# Altium schematic sheet Bi_Dir_Circuit.SchDoc
size A2; SheetNumber: 3; SheetTotal: 7
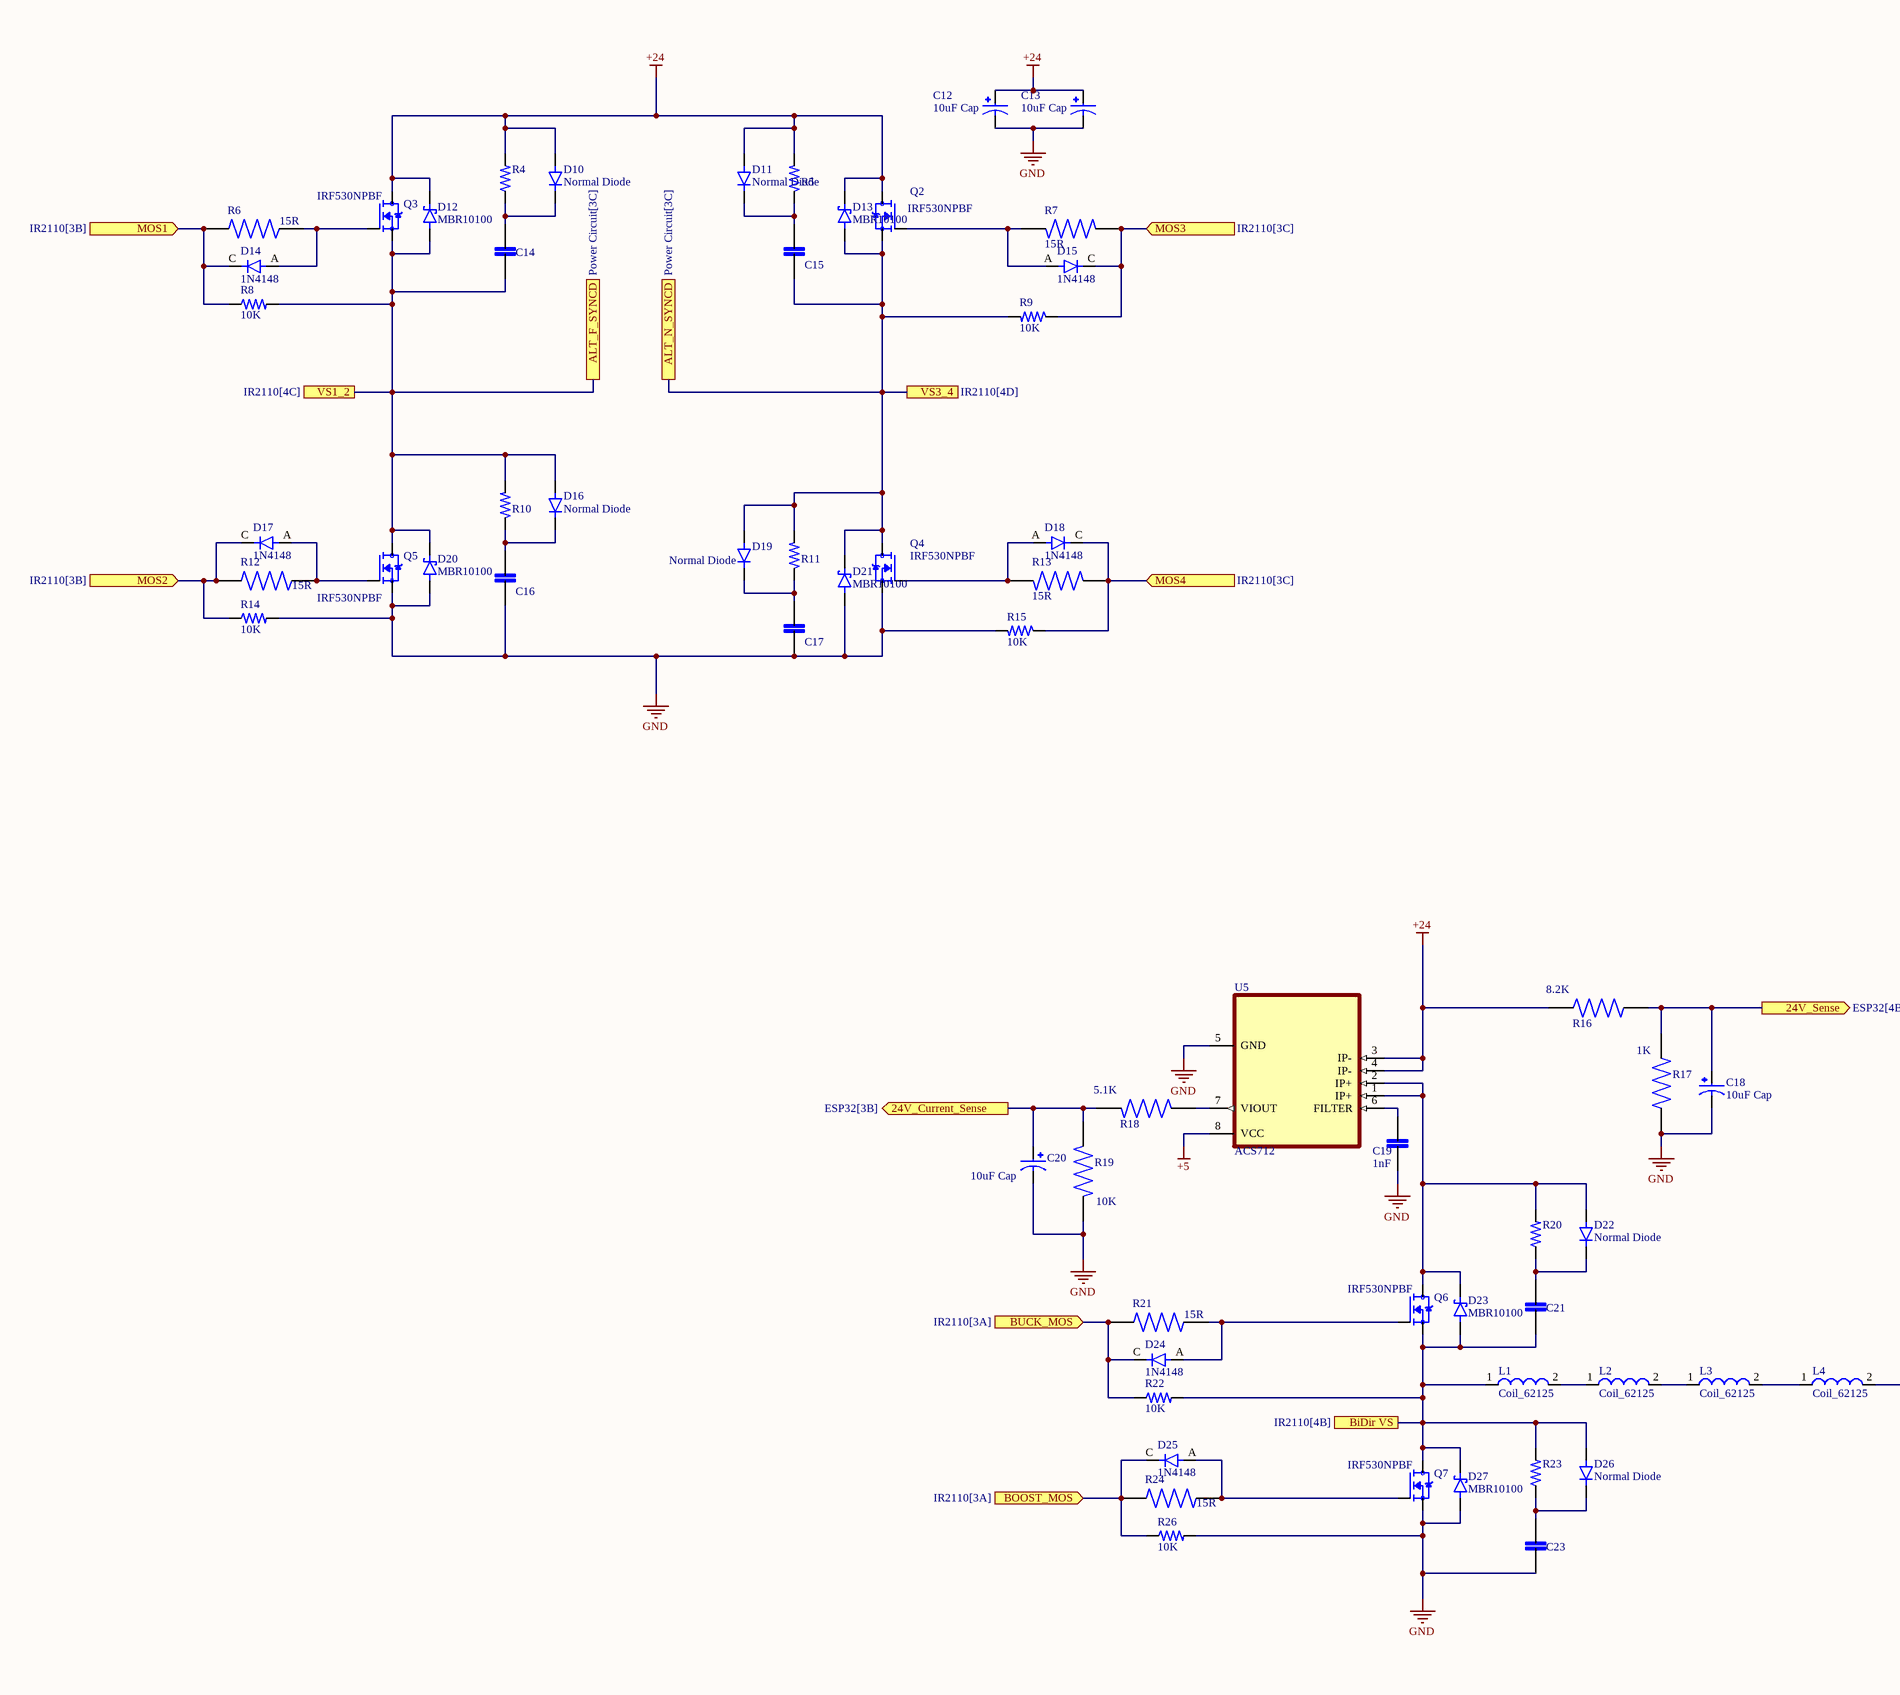
[diagram p0: Bi_Dir_Circuit.SchDoc, left]
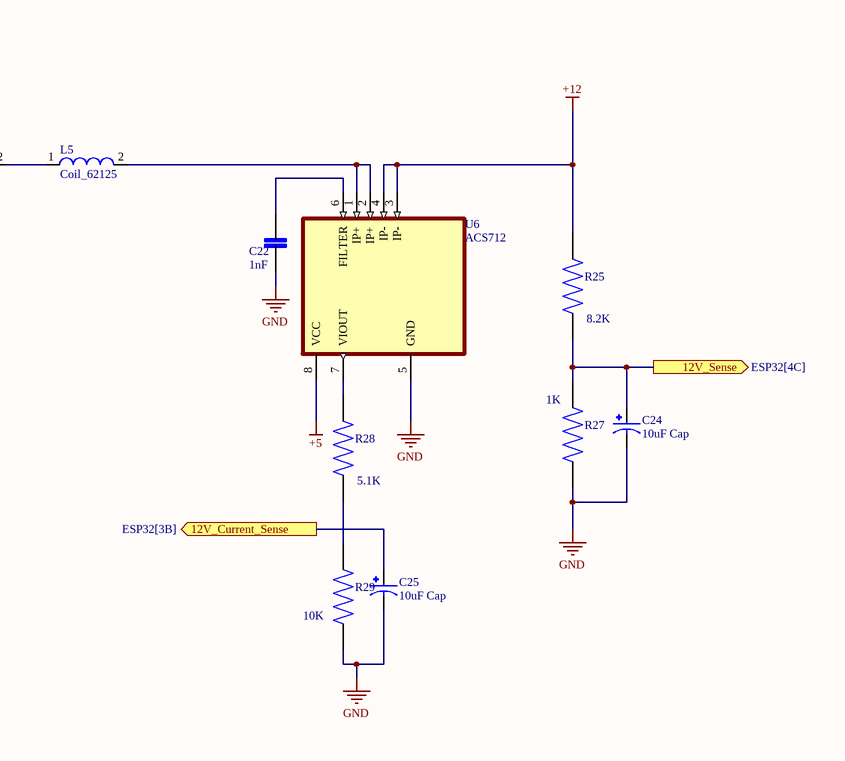
[diagram p1: Bi_Dir_Circuit.SchDoc, right]

## Parts
C12  10uF Cap  [2200uF_Cap]
C13  10uF Cap  [2200uF_Cap]
C14  Ceramic Capacitor  [Ceramic Capacitor]  (value not drawn)
C15  Ceramic Capacitor  [Ceramic Capacitor]  (value not drawn)
C16  Ceramic Capacitor  [Ceramic Capacitor]  (value not drawn)
C17  Ceramic Capacitor  [Ceramic Capacitor]  (value not drawn)
C18  10uF Cap  [CAP_10uF]
C19  1nF  [Ceramic Capacitor]
C20  10uF Cap  [CAP_10uF]
C21  Ceramic Capacitor  [Ceramic Capacitor]  (value not drawn)
C22  1nF  [Ceramic Capacitor]
C23  Ceramic Capacitor  [Ceramic Capacitor]  (value not drawn)
C24  10uF Cap  [CAP_10uF]
C25  10uF Cap  [CAP_10uF]
D10  Normal Diode  [Common Trhough Hole]
D11  Normal Diode  [Common Trhough Hole]
D12  MBR10100  [MBR10100]
D13  MBR10100  [MBR10100]
D14  1N4148  [1N4007 DIODE]
D15  1N4148  [1N4007 DIODE]
D16  Normal Diode  [Common Trhough Hole]
D17  1N4148  [1N4007 DIODE]
D18  1N4148  [1N4007 DIODE]
D19  Normal Diode  [Common Trhough Hole]
D20  MBR10100  [MBR10100]
D21  MBR10100  [MBR10100]
D22  Normal Diode  [Common Trhough Hole]
D23  MBR10100  [MBR10100]
D24  1N4148  [1N4007 DIODE]
D25  1N4148  [1N4007 DIODE]
D26  Normal Diode  [Common Trhough Hole]
D27  MBR10100  [MBR10100]
L1  Coil_62125  [Coil 65125]
L2  Coil_62125  [Coil 65125]
L3  Coil_62125  [Coil 65125]
L4  Coil_62125  [Coil 65125]
L5  Coil_62125  [Coil 65125]
Q2  IRF530NPBF  [IRF530N]
Q3  IRF530NPBF  [IRF530N]
Q4  IRF530NPBF  [IRF530N]
Q5  IRF530NPBF  [IRF530N]
Q6  IRF530NPBF  [IRF530N]
Q7  IRF530NPBF  [IRF530N]
R4  Resistor  [Resistor_Through Hole]  (value not drawn)
R5  Resistor  [Resistor_Through Hole]  (value not drawn)
R6  15R  [Resistor_Through Hole]
R7  15R  [Resistor_Through Hole]
R8  10K  [Resistor_Through Hole]
R9  10K  [Resistor_Through Hole]
R10  Resistor  [Resistor_Through Hole]  (value not drawn)
R11  Resistor  [Resistor_Through Hole]  (value not drawn)
R12  15R  [Resistor_Through Hole]
R13  15R  [Resistor_Through Hole]
R14  10K  [Resistor_Through Hole]
R15  10K  [Resistor_Through Hole]
R16  8.2K  [Resistor_Through Hole]
R17  1K  [Resistor_Through Hole]
R18  5.1K  [Resistor_Through Hole]
R19  10K  [Resistor_Through Hole]
R20  Resistor  [Resistor_Through Hole]  (value not drawn)
R21  15R  [Resistor_Through Hole]
R22  10K  [Resistor_Through Hole]
R23  Resistor  [Resistor_Through Hole]  (value not drawn)
R24  15R  [Resistor_Through Hole]
R25  8.2K  [Resistor_Through Hole]
R26  10K  [Resistor_Through Hole]
R27  1K  [Resistor_Through Hole]
R28  5.1K  [Resistor_Through Hole]
R29  10K  [Resistor_Through Hole]
U5  ACS712  [ACS712]
U6  ACS712  [ACS712]

## Ports
12V_Current_Sense (out, see ESP32[3B]), 12V_Sense (out, see ESP32[4C]), 24V_Current_Sense (out, see ESP32[3B]), 24V_Sense (out, see ESP32[4B]), ALT_F_SYNCD (see Power Circuit[3C]), ALT_N_SYNCD (see Power Circuit[3C]), BiDir VS (see IR2110[4B]), BOOST_MOS (in, see IR2110[3A]), BUCK_MOS (in, see IR2110[3A]), MOS1 (in, see IR2110[3B]), MOS2 (in, see IR2110[3B]), MOS3 (in, see IR2110[3C]), MOS4 (in, see IR2110[3C]), VS1_2 (see IR2110[4C]), VS3_4 (see IR2110[4D])

## Nets
+5: U5.8(VCC) U6.8(VCC)
+12: R25.2 U6.3(IP-) U6.4(IP-)
+24: C12.P C13.P D10.2(A) D11.2(A) D12.1(K) D13.1(K) Q2.2(D) Q3.2(D) R4.2 R5.2 R16.1 U5.3(IP-) U5.4(IP-)
GND: C12.N C13.N C16.1 C17.1 C18.N C19.1 C20.N C22.1 C23.1 C24.N C25.N D20.3(A) D21.3(A) D27.3(A) Q4.3(S) Q5.3(S) Q7.3(S) R14.2 R15.2 R17.1 R19.1 R26.2 R27.1 R29.1 U5.5(GND) U6.5(GND)
12V_Current_Sense: C25.P ; port 12V_Current_Sense
12V_Sense: C24.P R25.1 R27.2 ; port 12V_Sense
24V_Current_Sense: C20.P R18.1 R19.2 ; port 24V_Current_Sense
24V_Sense: C18.P R16.2 R17.2 ; port 24V_Sense
ALT_F_SYNCD: C14.1 D12.3(A) D16.2(A) D20.1(K) Q3.3(S) Q5.2(D) R8.2 R10.2 ; port VS1_2, port ALT_F_SYNCD
ALT_N_SYNCD: C15.1 D13.3(A) D19.2(A) D21.1(K) Q2.3(S) Q4.2(D) R9.2 R11.2 ; port VS3_4, port ALT_N_SYNCD
BiDir VS: C21.1 D23.3(A) D26.2(A) D27.1(K) L1.1 Q6.3(S) Q7.2(D) R22.2 R23.2 ; port BiDir VS
BOOST_MOS: D25.C R24.1 R26.1 ; port BOOST_MOS
BUCK_MOS: D24.C R21.1 R22.1 ; port BUCK_MOS
MOS1: D14.C R6.1 R8.1 ; port MOS1
MOS2: D17.C R12.1 R14.1 ; port MOS2
MOS3: D15.C R7.1 R9.1 ; port MOS3
MOS4: D18.C R13.1 R15.1 ; port MOS4
NetC14_2: C14.2 D10.1(K) R4.1
NetC15_2: C15.2 D11.1(K) R5.1
NetC16_2: C16.2 D16.1(K) R10.1
NetC17_2: C17.2 D19.1(K) R11.1
NetC19_2: C19.2 U5.6(FILTER)
NetC21_2: C21.2 D22.1(K) R20.1
NetC22_2: C22.2 U6.6(FILTER)
NetC23_2: C23.2 D26.1(K) R23.1
NetD14_A: D14.A Q3.1(G) R6.2
NetD15_A: D15.A Q2.1(G) R7.2
NetD17_A: D17.A Q5.1(G) R12.2
NetD18_A: D18.A Q4.1(G) R13.2
NetD22_2: D22.2(A) D23.1(K) Q6.2(D) R20.2 U5.1(IP+) U5.2(IP+)
NetD24_A: D24.A Q6.1(G) R21.2
NetD25_A: D25.A Q7.1(G) R24.2
NetL1_2: L1.2 L2.1
NetL2_2: L2.2 L3.1
NetL3_2: L3.2 L4.1
NetL4_2: L4.2 L5.1
NetL5_2: L5.2 U6.1(IP+) U6.2(IP+)
NetR18_2: R18.2 U5.7(VIOUT)
NetR28_1: R28.1 R29.2
NetR28_2: R28.2 U6.7(VIOUT)

## Library data of the parts
C12 C13 C18 C20 C24 C25 = 10uF Cap: CAP ALUM 10UF 20% 50V RADIAL; MP: ECE-A1HN100UI; MF: Panasonic; SnapEDA_Link: https://www.snapeda.com/parts/ECE-A1HN100UI/Panasonic/view-part/2321690/?ref=snap; Price: None; Check_prices: https://www.snapeda.com/parts/ECE-A1HN100UI/Panasonic/view-part/2321690/?ref=eda; Value: *; Availability: In Stock; Package: RADIAL-2 Panasonic
C14-C17 C19 C21-C23 = Ceramic Capacitor: MP: LD051A121KAB2A; MF: AVX; SnapEDA_Link: https://www.snapeda.com/parts/LD051A121KAB2A/AVX/view-part/?ref=snap; Package: 0805 AVX; Check_prices: https://www.snapeda.com/parts/LD051A121KAB2A/AVX/view-part/?ref=eda; Purchase-URL: https://pricing.snapeda.com/search/part/LD051A121KAB2A/?ref=eda; Price: None; Value: *; Availability: In Stock
D10 D11 D16 D19 D22 D26 = Normal Diode: MF: NTE Electronics, Inc.; MP: 1N4007; Package: DO-41 NTE Electronics; Check_prices: https://www.snapeda.com/parts/1N4007/NTE+Electronics/view-part/?ref=eda; Value: *; Purchase-URL: https://pricing.snapeda.com/search/part/1N4007/?ref=eda; Availability: In Stock; SnapEDA_Link: https://www.snapeda.com/parts/1N4007/NTE+Electronics/view-part/?ref=snap; Price: None
D12 D13 D20 D21 D23 D27 = MBR10100: MF: Diodes Inc.; MP: 1N5817-T; Package: DO-41 Diodes Inc.; Price: None; Check_prices: https://www.snapeda.com/parts/1N5817-T/Diodes+Inc./view-part/?ref=eda; Value: *; SnapEDA_Link: https://www.snapeda.com/parts/1N5817-T/Diodes+Inc./view-part/?ref=snap; Availability: In Stock; Purchase-URL: https://pricing.snapeda.com/search/part/1N5817-T/?ref=eda
D14 D15 D17 D18 D24 D25 = 1N4007: Diode Standard 1000 V 1A Through Hole DO-41; MF: NTE Electronics, Inc.; Package: DO-41 NTE Electronics; Check_prices: https://www.snapeda.com/parts/1N4007/NTE+Electronics/view-part/?ref=eda; Value: *; Purchase-URL: https://pricing.snapeda.com/search/part/1N4007/?ref=eda; Availability: In Stock; SnapEDA_Link: https://www.snapeda.com/parts/1N4007/NTE+Electronics/view-part/?ref=snap; MP: 1N4007; Price: None
L1-L5 = Coil_62125: Inductor Power Wirewound 470uH 10% 1KHz 25Q-Factor Ferrite 210mA 3.3Ohm DCR T/R; MF: Bourns; MP: SDR0604-471KL; Digi-Key_Part_Number: SDR0604-471KLCT-ND; Package: Nonstandard Bourns; Value: *; SnapEDA_Link: https://www.snapeda.com/parts/SDR0604-471KL/Bourns/view-part/567387/?ref=snap; Digi-Key_Purchase_URL: https://www.digikey.com/product-detail/en/bourns-inc/SDR0604-471KL/SDR0604-471KLCT-ND/2352941?utm_source=snapeda&utm_medium=aggregator&utm_campaign=symbol
Q2-Q7 = IRF530NPBF: RoHS Compliant | Low RDS(on) | Industry-leading quality | Dynamic dv/dt Rating | Fast Switching | Fully Avalanche Rated | 175C Operating Temperature; MF: Infineon Technologies; Purchase-URL: https://pricing.snapeda.com/search/part/IRF530NPBF/?ref=eda; Check_prices: https://www.snapeda.com/parts/IRF530NPBF/Infineon+Technologies/view-part/?ref=eda; SnapEDA_Link: https://www.snapeda.com/parts/IRF530NPBF/Infineon+Technologies/view-part/?ref=snap; Price: None; Availability: In Stock; Package: TO-220 Infineon; MP: IRF530NPBF; Value: *
R4 R5 R8-R11 R14 R15 R20 R22 R23 R26 = Resistor: Power_Rating: .25 W; MP: 2-2176053-0; Tolerance: 1%; Resistance: .33; MF: TE Connectivity; Price: None; Availability: In Stock; EU_RoHS_Compliance: Compliant with Exemptions; Package: 0805; Value: *; SnapEDA_Link: https://www.snapeda.com/parts/2-2176053-0/TE+Connectivity/view-part/?ref=snap; Check_prices: https://www.snapeda.com/parts/2-2176053-0/TE+Connectivity/view-part/?ref=eda
R6 R7 R12 R13 R16-R19 R21 R24 R25 R27-R29 = Resistor_Through Hole: 1.02 Ohms Â±1% 0.25W, 1/4W Through Hole Resistor Axial Metal Film; MP: MFR-25FTE52-1R; MF: Yageo; Availability: Warning; Value: *; Check_prices: https://www.snapeda.com/parts/MFR-25FTE52-1R/Yageo/view-part/4629919/?ref=eda; Package: Axial Yageo; Price: None; SnapEDA_Link: https://www.snapeda.com/parts/MFR-25FTE52-1R/Yageo/view-part/4629919/?ref=snap; Purchase-URL: https://pricing.snapeda.com/search/part/MFR-25FTE52-1R/?ref=eda
U5 U6 = ACS712: Current Sensor 5A 1 Channel Hall Effect, Open Loop Bidirectional 8-SOIC (0.154, 3.90mm Width); MP: ACS712ELCTR-05B-T; MF: Allegro MicroSystems LLC; SnapEDA_Link: https://www.snapeda.com/parts/ACS712ELCTR-05B-T/Allegro+MicroSystems+LLC/view-part/?ref=snap; Package: SOIC-8 Allegro MicroSystems LLC; Check_prices: https://www.snapeda.com/parts/ACS712ELCTR-05B-T/Allegro+MicroSystems+LLC/view-part/?ref=eda; Purchase-URL: https://pricing.snapeda.com/search/part/ACS712ELCTR-05B-T/?ref=eda; Price: None; Value: *; Availability: In Stock